# EasyEDA Pro project 01_立创eda专业版_esp32语音助手-自制版_2024-07-09.epro, board PCB2
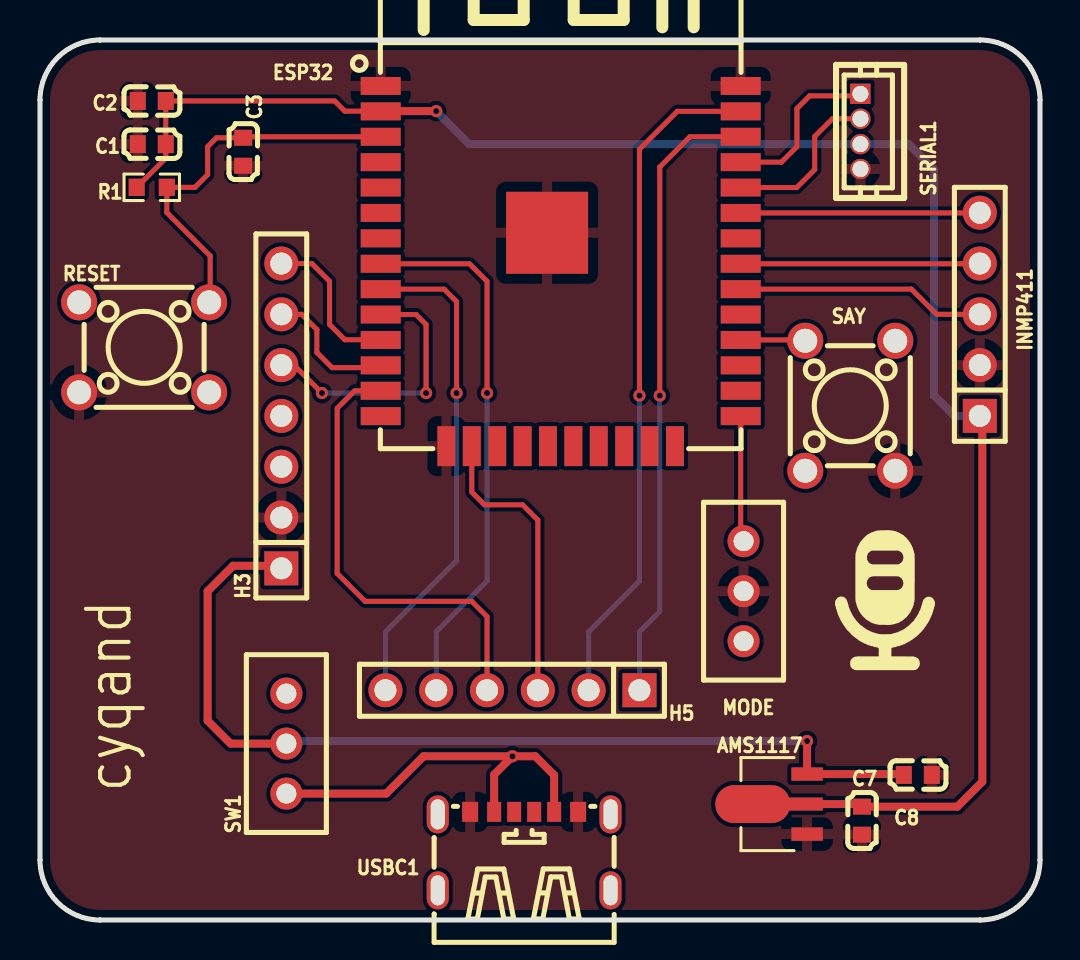
[diagram p12: board, top side]
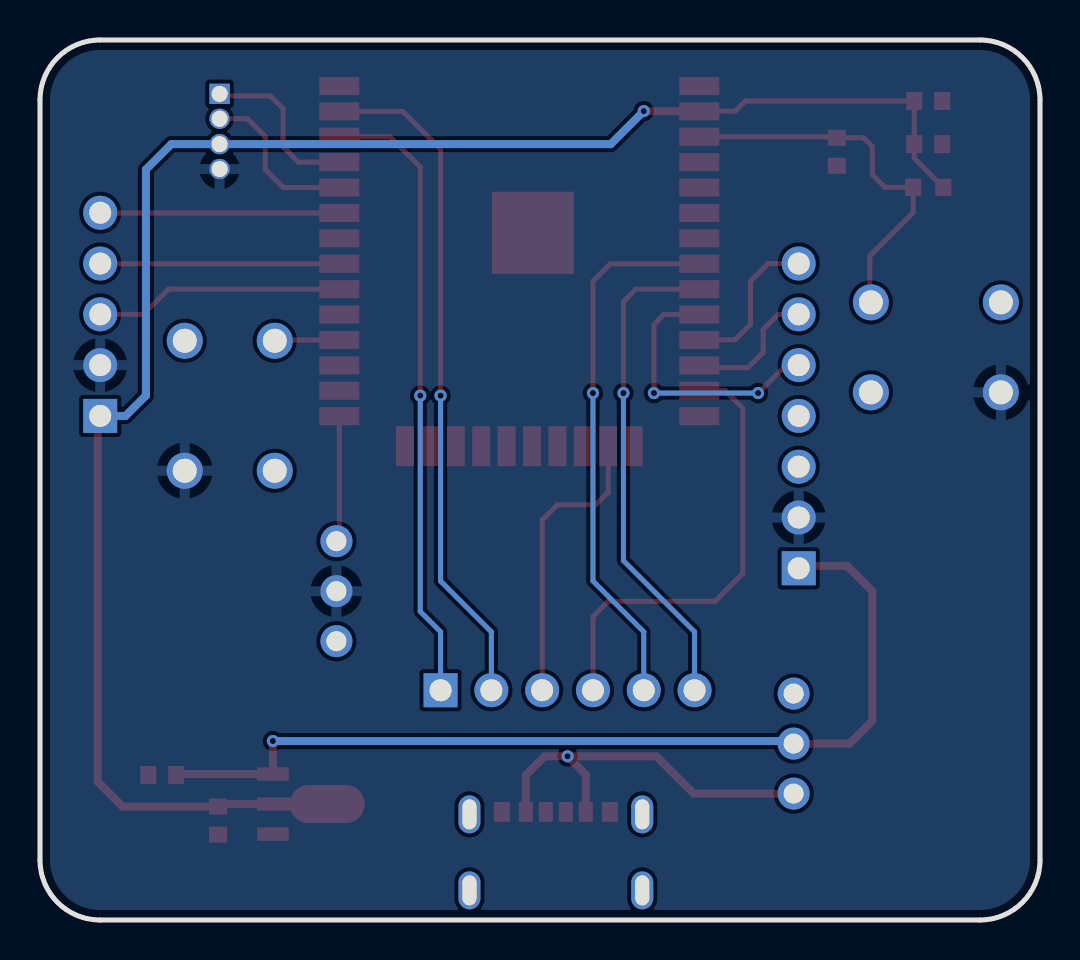
[diagram p13: board, bottom side, seen from below]

Outline 50 x 44 mm; copper layers: Top Layer, Bottom Layer. Coordinates in mm from the lower left corner of the outline.
Outline path: 0,41 0,3 arc(0.88,0.88) 3,0 47,0 arc(49.12,0.88) 50,3 50,41 arc(49.12,43.12) 47,44 3,44 arc(0.88,43.12) 0,41
Stack: Top Layer 0.035mm / Dielectric1 1.51mm FR4 er 4.5 / Bottom Layer 0.035mm

## Design rules (mm)
template: JLCPCB Capability(Two Layers Board)
spacing copperThickness1oz (default): track to track 0.102, other pairs 0.152 to 0.3
spacing copperThickness2oz: track to track 0.203, other pairs 0.152 to 0.3
track width copperThickness1oz (default): min 0.127, default 0.254, max 2.54
track width copperThickness2oz: min 0.203, default 0.254, max 2.54
differential pair differentialPair (default): width min 0.127, default 0.254, max 2.54; gap min 0.152, default 0.152
via viaSize (default): diameter min 0.5, default 0.61, max 10; hole min 0.3, default 0.305, max 6.3

## Placement (name value [footprint] x y rotation side)
AMS1117  AMS1117-3.3V  [SOT-89-3_L4.5-W2.5-P1.50-LS4.2-BR]  37 5.8 0 top
C1  100nF  [C0603]  5.59 38.79 180 top
C2  10uF  [C0603]  5.59 40.95 180 top
C3  1uF  [C0603]  10.16 38.41 270 top
C7  10uF  [C0603]  41.1 4.97 270 top
C8  10uF  [C0603]  43.89 7.25 180 top
ESP32  ESP32-WROOM-32-N4  [WIFIM-SMD_ESP32-WROOM-32-N4]  26.03 32.7 0 top
H3  PZ254V-11-07P  [HDR-TH_7P-P2.54-V-M]  12.06 25.2 90 top
H5  PZ254V-11-06P  [HDR-TH_6P-P2.54-V-M]  23.62 11.49 180 top
INMP411  PZ254V-11-05P  [HDR-TH_5P-P2.54-V-M]  46.99 30.28 90 top
MODE  SS-12D00-G3  [SW-TH_SS-12D00-G3]  35.18 16.44 270 top
R1  10kΩ  [R0603]  5.59 36.63 180 top
RESET  TS-1002-07026  [SW-TH_4P-L6.0-W6.0-P4.50-LS6.5]  5.21 28.63 0 top
SAY  TS-1002-07026  [SW-TH_4P-L6.0-W6.0-P4.50-LS6.5]  40.51 25.71 90 top
SERIAL1  DF13-4P-1.25DSA  [CONN-TH_DF13-4P-1.25DSA]  41.02 39.43 90 top
SW1  SS-12D00-G3  [SW-TH_SS-12D00-G3]  12.32 8.82 90 top
USBC1  TYPE-C 6P(073)  [TYPE-C-SMD_TYPE-C-6P]  24.21 3.44 0 top

## Footprints (pads in the part's own frame, mm; a bottom-side part is the same pattern mirrored in y, then rotated)
C0603
  rect 0.8x0.9 smd: 1(-0.7,0) 2(0.7,0)
CONN-TH_DF13-4P-1.25DSA
  rect 1.016x1.016 hole 0.8: 1(1.879,0)
  round 1.016 hole 0.8: 2(0.635,0) 3(-0.635,0) 4(-1.879,0)
HDR-TH_5P-P2.54-V-M
  rect 1.7x1.7 hole 1.1: 1(-5.08,0)
  round 1.7 hole 1.1: 2(-2.54,0) 3(0,0) 4(2.54,0) 5(5.08,0)
HDR-TH_6P-P2.54-V-M
  rect 1.7x1.7 hole 1.1: 1(-6.35,0)
  round 1.7 hole 1.1: 2(-3.81,0) 3(-1.27,0) 4(1.27,0) 5(3.81,0) 6(6.35,0)
HDR-TH_7P-P2.54-V-M
  rect 1.7x1.7 hole 1.1: 1(-7.62,0)
  round 1.7 hole 1.1: 2(-5.08,0) 3(-2.54,0) 4(0,0) 5(2.54,0) 6(5.08,0) 7(7.62,0)
R0603
  rect 0.806x0.864 smd: 1(-0.753,0) 2(0.753,0)
SOT-89-3_L4.5-W2.5-P1.50-LS4.2-BR
  rect 1.575x0.672 smd: 1(1.356,-1.5) 3(1.356,1.5)
  custom 5.377x1.9 smd: 2(-1.356,0)
SW-TH_4P-L6.0-W6.0-P4.50-LS6.5
  round 1.8 hole 1.2: 1(-3.25,2.25) 2(3.25,2.25) 3(-3.25,-2.25) 4(3.25,-2.25)
SW-TH_SS-12D00-G3
  round 1.6 hole 1: 1(-2.5,0) 2(0,0) 3(2.5,0)
TYPE-C-SMD_TYPE-C-6P
  oval 1.1x1.9 hole 0.7x1.5: 7(-4.32,1.837) 7(-4.32,-1.962) 7(4.32,1.837) 7(4.32,-1.962)
  rect 0.7x1 smd: A5(-0.5,1.962) A9(1.5,1.962) B5(0.5,1.962) B9(-1.5,1.962)
  rect 0.8x1 smd: A12(2.7,1.962) B12(-2.7,1.962)
WIFIM-SMD_ESP32-WROOM-32-N4
  rect 2x0.9 smd: 1(-9,9.005) 2(-9,7.735) 3(-9,6.465) 4(-9,5.195) 5(-9,3.925) 6(-9,2.655) 7(-9,1.385) 8(-9,0.115) 9(-9,-1.155) 10(-9,-2.425) 11(-9,-3.695) 12(-9,-4.965) 13(-9,-6.235) 14(-9,-7.505) 25(9,-7.505) 26(9,-6.235) 27(9,-4.965) 28(9,-3.695) 29(9,-2.425) 30(9,-1.155) 31(9,0.115) 32(9,1.385) 33(9,2.655) 34(9,3.925) 35(9,5.195) 36(9,6.465) 37(9,7.735) 38(9,9.005)
  rect 0.9x2 smd: 15(-5.715,-9.005) 16(-4.445,-9.005) 17(-3.175,-9.005) 18(-1.905,-9.005) 19(-0.635,-9.005) 20(0.635,-9.005) 21(1.905,-9.005) 22(3.175,-9.005) 23(4.445,-9.005) 24(5.715,-9.005)
  rect 4.1x4.1 smd: 39(-0.68,1.665)

## Nets
3V3: AMS1117.2 C1.1 C2.1 C7.1 ESP32.2 INMP411.1 R1.2 SERIAL1.3
5V: AMS1117.3 C8.2 H3.1 SW1.2
5VIN: SW1.1 USBC1.A9 USBC1.B9
GND: AMS1117.1 C1.2 C2.2 C3.2 C7.2 C8.1 ESP32.1 ESP32.15 ESP32.38 ESP32.39 H3.2 INMP411.2 MODE.2 RESET.3 SAY.3 SERIAL1.4 USBC1.A12 USBC1.B12
IO0: ESP32.25 MODE.1
IO13: ESP32.16 H5.3
IO14: ESP32.13 H5.4
IO17: ESP32.28 SAY.2
IO18: ESP32.30 INMP411.3
IO19: ESP32.31 INMP411.4
IO21: ESP32.33 INMP411.5
IO22: ESP32.36 H5.1
IO23: ESP32.37 H5.2
IO25: ESP32.10 H3.5
IO26: ESP32.11 H3.7
IO27: ESP32.12 H3.6
IO32: ESP32.8 H5.5
IO33: ESP32.9 H5.6
RXD: ESP32.34 SERIAL1.2
TXD: ESP32.35 SERIAL1.1
$2N5935: C3.1 ESP32.3 R1.1 RESET.2

Pads without a net: ESP32 4 5 6 7 14 17 18 19 20 21 22 23 24 26 27 29 32; H3 3 4; MODE 3; RESET 1 4; SAY 1 4; SW1 3; USBC1 7 A5 B5

## Via types
v1: diameter 0.61, hole 0.305, Top Layer to Bottom Layer, 9 vias

## Routing (per net, layer and track width the routed paths; a pad name or vN(x,y) marks a point on that pad's centre or on a via; arc(x,y) is an arc through that point)
3V3: length 89.2
  Top Layer w0.254: R1.2 6.29,38.09 C1.1 C2.1 14.73,40.95 15.24,40.44 17.02,40.44 ESP32.2
  Top Layer w0.4: AMS1117.2 40.97,5.8 C7.1 45.87,5.67 47.12,6.92 47.12,25.08 INMP411.1 ; ESP32.2 17.05,40.44 v1(19.81,40.44)
  Bottom Layer w0.4: v1(19.81,40.44) 21.46,38.79 SERIAL1.3 43.43,38.79 44.7,37.52 44.7,26.22 45.72,25.2 INMP411.1
5V: length 47.7
  Top Layer w0.4: v1(38.35,8.95) AMS1117.3 43.15,7.3 C8.2 ; H3.1 11.94,17.71 9.65,17.71 8.38,16.44 8.38,9.96 9.53,8.82 SW1.2
  Bottom Layer w0.4: SW1.2 12.45,8.95 v1(38.35,8.95)
5VIN: length 19.5
  Top Layer w0.4: USBC1.A9 25.71,7.24 24.76,8.19 v1(23.62,8.19) ; v1(23.62,8.19) 19.18,8.19 17.31,6.32 SW1.1 ; v1(23.62,8.19) 22.71,7.27 USBC1.B9
IO0: length 6.3
  Top Layer w0.254: MODE.1 35.03,19.08 ESP32.25
IO13: length 14.7
  Top Layer w0.254: H5.3 24.89,20 24.13,20.76 22.22,20.76 21.59,21.39 ESP32.16
IO14: length 22.9
  Top Layer w0.254: ESP32.13 15.74,26.46 14.86,25.58 14.86,17.33 16.26,15.93 21.59,15.93 22.35,15.17 H5.4
IO17: length 3.2
  Top Layer w0.254: ESP32.28 38.22,29 SAY.2
IO18: length 12.5
  Top Layer w0.254: INMP411.3 44.83,30.28 43.57,31.54 ESP32.30
IO19: length 12
  Top Layer w0.254: INMP411.4 46.98,32.81 ESP32.31
IO21: length 12
  Top Layer w0.254: ESP32.33 46.98,35.35 INMP411.5
IO22: length 31.3
  Top Layer w0.254: v1(30.99,26.22) 30.99,37.65 32.5,39.16 ESP32.36
  Bottom Layer w0.254: v1(30.99,26.22) 30.99,15.42 29.97,14.41 H5.1
IO23: length 34
  Top Layer w0.254: v1(29.97,26.22) 29.97,38.54 31.87,40.43 ESP32.37
  Bottom Layer w0.254: H5.2 27.43,14.41 29.97,16.95 v1(29.97,26.22)
IO25: length 13.7
  Top Layer w0.254: ESP32.10 18.81,30.27 19.3,29.78 v1(19.3,26.35) ; H3.5 12.7,27.74 v1(14.1,26.35)
  Bottom Layer w0.254: v1(19.3,26.35) v1(14.1,26.35)
IO26: length 7.8
  Top Layer w0.254: ESP32.11 17.02,29.01 15.24,29.01 14.48,29.78 14.48,31.94 13.59,32.82 H3.7
IO27: length 6.8
  Top Layer w0.254: ESP32.12 16.92,27.62 14.6,27.62 13.84,28.38 13.84,29.52 13.08,30.28 H3.6
IO32: length 27.2
  Top Layer w0.254: ESP32.8 21.47,32.81 22.35,31.94 v1(22.35,26.35)
  Bottom Layer w0.254: v1(22.35,26.35) 22.35,16.95 19.81,14.41 H5.5
IO33: length 25
  Top Layer w0.254: v1(20.83,26.35) 20.83,30.92 20.21,31.54 ESP32.9
  Bottom Layer w0.254: v1(20.83,26.35) 20.83,17.97 17.27,14.41 H5.6
RXD: length 8.4
  Top Layer w0.254: ESP32.34 37.83,36.62 38.74,37.52 38.74,39.17 39.62,40.06 SERIAL1.2
TXD: length 8.5
  Top Layer w0.254: ESP32.35 37.07,37.89 37.85,38.67 37.85,40.57 38.48,41.21 40.92,41.21 SERIAL1.1
$2N5935: length 19.2
  Top Layer w0.254: RESET.2 8.51,30.94 8.51,33.2 6.34,35.37 R1.1 7.75,36.63 8.38,37.27 8.38,38.67 8.83,39.11 C3.1 10.21,39.16 ESP32.3

## Copper pours and planes (outline as drawn; the poured copper is in the pictures)
GND on Top Layer: -1.27,44.51 51.69,44.51 51.69,-0.83 -1.27,-0.83
GND on Bottom Layer: -2.54,45.02 52.58,45.02 52.58,-1.34 -2.54,-1.34

## Text on the board
Top Silkscreen Layer: cyqand
